# Altium project 28Pins_Project_V1I1.PrjPcb (part 2 of 3)
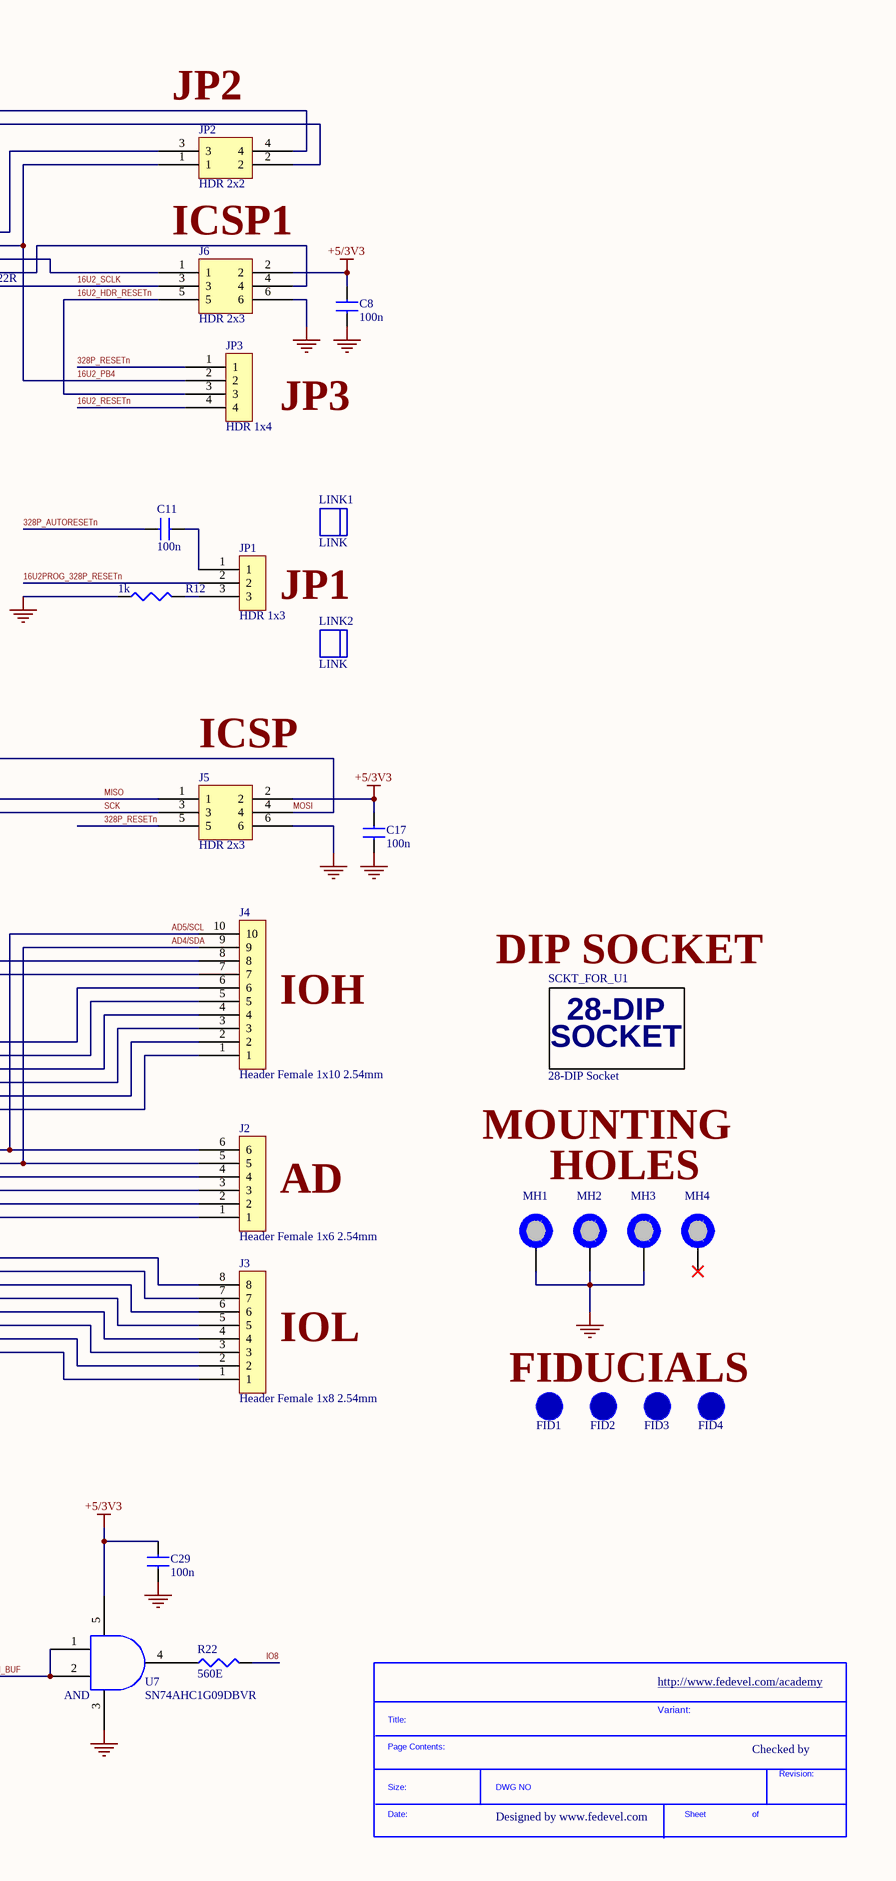
[diagram p3: [03] - 28PINS SCHEMATIC.SchDoc, right]

## Sheet [03] - 28PINS SCHEMATIC.SchDoc: 28Pins (continued)
### Library data of the parts
C1 C2 = EEE-1AA101WR: Cap Aluminum 100uF 10V 20% (5 X 5.4mm) SMD 50mA 1000 hr 85°C T/R; Manufacturer: Panasonic; Life (Hours): 1000Hour; Supplier 1: Digi-Key; Manufacturer Part Number: EEE-1AA101WR; Stock 1: 0; Pricing 1: 1=0.39, 10=0.266, 50=0.1772, 100=0.1505, 500=0.1063 (USD); Mount: Surface Mount,PCB; Case/Package: Radial; Contact Plating: Tin; Min Operating Temperature: -40°C; Max Operating Temperature: 85°C; Capacitance: 100uF; Tolerance: 20%; Ripple Current: 50mA; Voltage Rating: 10V; Packaging: Tape and Reel; Package Quantity: 1; Voltage Rating (DC): 10V; Termination: SMD/SMT; Ripple Current (AC): 50mA; Series: S; Construction: Cylindrical; Diameter: 5mm; Length: 5.5mm; Height: 5.4mm; Height - Seated (Max): 0.213inch; Radiation Hardening: No; Lead Free: Lead Free; RoHS Compliant: Yes; REACH SVHC: Unknown; ComponentLink1URL: https://industrial.panasonic.com/cdbs/www-data/pdf/RDE0000/DME0000COL90.pdf?src-supplier=Mouser; ComponentLink1Description: https://industrial.panasonic.com/cdbs/www-data/pdf/RDE0000/DME0000COL90.pdf?src-supplier=Mouser; ComponentLink2URL: https://industrial.panasonic.com/cdbs/www-data/pdf/RDE0000/DME0000COL90.pdf?src-supplier=Allied+Electronics; ComponentLink2Description: https://industrial.panasonic.com/cdbs/www-data/pdf/RDE0000/DME0000COL90.pdf?src-supplier=Allied+Electronics; ComponentLink3URL: https://industrial.panasonic.com/cdbs/www-data/pdf/RDE0000/DME0000COL90.pdf?src-supplier=Avnet; ComponentLink3Description: https://industrial.panasonic.com/cdbs/www-data/pdf/RDE0000/DME0000COL90.pdf?src-supplier=Avnet; ComponentLink4URL: http://industrial.panasonic.com/www-data/pdf/ABA0000/ABA0000CE2.pdf?src-supplier=Future+Electronics; ComponentLink4Description: http://industrial.panasonic.com/www-data/pdf/ABA0000/ABA0000CE2.pdf?src-supplier=Future+Electronics; ComponentLink5URL: https://industrial.panasonic.com/cdbs/www-data/pdf/RDE0000/DME0000COL90.pdf?src-supplier=Verical; ComponentLink5Description: https://industrial.panasonic.com/cdbs/www-data/pdf/RDE0000/DME0000COL90.pdf?src-supplier=Verical; Supplier Part Number 1: PCE3867CT-ND
C3 C12 C13 C19 C21 C22 C34 = C2012X5R1C106M125AC: CERAMIC CAPACITOR, 10UF, 16V, X5R, 20%, 0805, FULL REEL; Product Range:C Series; Capacitance:10 F; Capacitance Tolerance: 20%; Dielectric Characteristic:X5R; Voltage Rating:16V; Ceramic Capacitor Case:0805 [2012 Metric]; MSL:- ;RoHS Compliant: Yes; Manufacturer: TDK; Supplier 1: Digi-Key; Manufacturer Part Number: C2012X5R1C106M125AC; Stock 1: 0; Mount: Surface Mount; Case/Package: 0805; Number of Pins: 2; Weight: 0.000194oz; Case Code (Metric): 2012; Case Code (Imperial): 0805; Dielectric Material: Ceramic; Min Operating Temperature: -55°C; Max Operating Temperature: 85°C; Capacitance: 10uF; Tolerance: 20%; Voltage Rating: 16V; Packaging: Tape and Reel; Voltage Rating (DC): 16V; Dielectric: X5R; Termination: SMD/SMT; Package Quantity: 1; Composition: Ceramic; Length: 2mm; Height: 1.25mm; Width: 0.049inch; Depth: 1.25mm; Thickness: 0.057inch; REACH SVHC: No SVHC; Lead Free: Lead Free; ComponentLink1URL: https://media.digikey.com/pdf/Data%20Sheets/TDK%20PDFs/Multilayer%20Ceramic%20Chip%20Cap(up%20to%2050V).pdf?src-supplier=Digi-Key; ComponentLink1Description: https://media.digikey.com/pdf/Data%20Sheets/TDK%20PDFs/Multilayer%20Ceramic%20Chip%20Cap(up%20to%2050V).pdf?src-supplier=Digi-Key; ComponentLink2URL: http://www.farnell.com/datasheets/1913358.pdf?src-supplier=Element14; ComponentLink2Description: http://www.farnell.com/datasheets/1913358.pdf?src-supplier=Element14; ComponentLink3URL: https://product.tdk.com/info/en/documents/chara_sheet/C2012X5R1C106M125AC.pdf?src-supplier=Newark; ComponentLink3Description: https://product.tdk.com/info/en/documents/chara_sheet/C2012X5R1C106M125AC.pdf?src-supplier=Newark; Supplier Part Number 1: 445-4115-1-ND
C4-C6 C8 C11 C14-C17 C20 C23 C24 C26 C28-C33 = C2012X7R1H104K085AA: TDK - C2012X7R1H104K085AA - SMD Multilayer Ceramic Capacitor, 0.1 µF, 50 V, 0805 [2012 Metric], ± 10%, X7R, C Series; Capacitance: 100nF; Voltage Rating: 50V; Supplier 1: Digi-Key; Manufacturer: TDK; Manufacturer Part Number: C2012X7R1H104K085AA; Stock 1: 241464; Pricing 1: 1=0.17, 10=0.119, 100=0.0561, 500=0.0394, 1000=0.0326 (USD); Mount: Surface Mount; Case/Package: 0805; Number of Pins: 2; Weight: 0.000194oz; Case Code (Metric): 2012; Case Code (Imperial): 0805; Dielectric Material: Ceramic; Min Operating Temperature: -55°C; Max Operating Temperature: 125°C; Tolerance: 10%; Dielectric: X7R; Packaging: Tape and Reel; Voltage Rating (DC): 50V; Termination: SMD/SMT; Package Quantity: 1; Composition: Ceramic; Voltage: 50V; Length: 2mm; Height: 0.85mm; Depth: 1.25mm; Width: 0.049inch; Thickness: 0.037inch; Radiation Hardening: No; REACH SVHC: No SVHC; Lead Free: Lead Free; ComponentLink1URL: http://uk.rs-online.com/webdocs/1532/0900766b81532cd0.pdf?src-supplier=RSComponents; ComponentLink1Description: http://uk.rs-online.com/webdocs/1532/0900766b81532cd0.pdf?src-supplier=RSComponents; ComponentLink2URL: https://product.tdk.com/info/en/catalog/datasheets/mlcc_commercial_general_en.pdf?src-supplier=Digi-Key; ComponentLink2Description: https://product.tdk.com/info/en/catalog/datasheets/mlcc_commercial_general_en.pdf?src-supplier=Digi-Key; ComponentLink3URL: http://www.tdk.co.jp/tefe02/e412_c.pdf?src-supplier=Future+Electronics; ComponentLink3Description: http://www.tdk.co.jp/tefe02/e412_c.pdf?src-supplier=Future+Electronics; ComponentLink4URL: http://www.farnell.com/datasheets/1796654.pdf?src-supplier=Newark; ComponentLink4Description: http://www.farnell.com/datasheets/1796654.pdf?src-supplier=Newark; ComponentLink5URL: http://www.farnell.com/datasheets/1571323.pdf?src-supplier=Element14; ComponentLink5Description: http://www.farnell.com/datasheets/1571323.pdf?src-supplier=Element14; Supplier Part Number 1: 445-7534-1-ND
C7 = C2012X5R1E105K125AA: TDK - C2012X5R1E105K125AA - SMD Multilayer Ceramic Capacitor, 1 µF, 25 V, 0805 [2012 Metric], ± 10%, X5R, C Series; Capacitance: 1uF; Voltage Rating: 25V; Supplier 1: Digi-Key; Manufacturer: TDK; Manufacturer Part Number: C2012X5R1E105K125AA; Stock 1: 11809; Pricing 1: 1=0.26, 10=0.174, 50=0.1046, 100=0.0883, 500=0.0604, 1000=0.0534 (USD); Mount: Surface Mount; Case/Package: 0805; Number of Pins: 2; Weight: 0.000194oz; Case Code (Metric): 2012; Case Code (Imperial): 0805; Dielectric Material: Ceramic; Min Operating Temperature: -55°C; Max Operating Temperature: 85°C; Tolerance: 10%; Package Quantity: 2000; Packaging: Tape and Reel; Voltage Rating (DC): 25V; Dielectric: X5R; Termination: SMD/SMT; Composition: Ceramic; Voltage: 25V; Length: 2mm; Height: 1.25mm; Width: 0.049inch; Thickness: 0.057inch; Depth: 1.25mm; Radiation Hardening: No; REACH SVHC: No SVHC; Lead Free: Lead Free; ComponentLink1URL: http://uk.rs-online.com/webdocs/1532/0900766b81532cd0.pdf?src-supplier=RSComponents; ComponentLink1Description: http://uk.rs-online.com/webdocs/1532/0900766b81532cd0.pdf?src-supplier=RSComponents; ComponentLink2URL: http://www.tdk.co.jp/tefe02/e412_c.pdf?src-supplier=Future+Electronics; ComponentLink2Description: http://www.tdk.co.jp/tefe02/e412_c.pdf?src-supplier=Future+Electronics; ComponentLink3URL: http://www.farnell.com/datasheets/1744655.pdf?src-supplier=Element14; ComponentLink3Description: http://www.farnell.com/datasheets/1744655.pdf?src-supplier=Element14; ComponentLink4URL: https://product.tdk.com/info/en/catalog/spec/mlccspec_commercial_general_midvoltage_en.pdf?src-supplier=Verical; ComponentLink4Description: https://product.tdk.com/info/en/catalog/spec/mlccspec_commercial_general_midvoltage_en.pdf?src-supplier=Verical; Supplier Part Number 1: 445-1419-1-ND
C9 C10 C25 C27 = C0805C180J5GACTU: CAP CER 18PF 50V C0G/NP0 0805; Manufacturer: KEMET; Dielectric Material: Ceramic; Tolerance: 5%; Dielectric: C0G; Temperature Coefficient: 30ppm/°C; Supplier 1: Digi-Key; Manufacturer Part Number: C0805C180J5GACTU; Stock 1: 173219; Pricing 1: 1=0.14, 10=0.1, 100=0.0468, 500=0.0328, 1000=0.0272 (USD); Mount: Surface Mount; Case/Package: 0805; Contact Plating: Tin,Matte; Min Operating Temperature: -55°C; Max Operating Temperature: 125°C; Capacitance: 18pF; Packaging: Tape and Reel; Voltage: 50V; Termination: SMD/SMT; Voltage Rating (DC): 50V; Length: 2mm; Height: 0.78mm; Depth: 1.25mm; Radiation Hardening: No; Lead Free: Lead Free; ComponentLink1URL: http://www.farnell.com/datasheets/1769375.pdf?src-supplier=Element14; ComponentLink1Description: http://www.farnell.com/datasheets/1769375.pdf?src-supplier=Element14; ComponentLink2URL: https://www.verical.com/server-webapp/html/getDatasheet?partID=385668&src-supplier=Verical; ComponentLink2Description: https://www.verical.com/server-webapp/html/getDatasheet?partID=385668&src-supplier=Verical; ComponentLink3URL: https://www.verical.com/server-webapp/html/getDatasheet?partID=759702&src-supplier=Verical; ComponentLink3Description: https://www.verical.com/server-webapp/html/getDatasheet?partID=759702&src-supplier=Verical; Supplier Part Number 1: 399-1112-1-ND
D1 = LGL29K-G2J1-24-Z: LED Uni-Color Green 572nm 2-Pin Chip 0603(1608Metric) T/R; Manufacturer: Osram Opto; Lens Color: White; Forward Current: 20mA; Forward Voltage: 2.2V; Luminous Intensity: 5.6mcd; Viewing Angle: 160°; Lens Style: Flat,Diffused,Colorless,Rectangular; Test Current: 2mA; Dominant Wavelength: 570nm; Luminous Flux: 0.012lm; Number of LEDs: 1; Lens Transparency: Diffused; Reverse Voltage: 12V; Lens Size: 0.8mm; Supplier 1: Digi-Key; Manufacturer Part Number: LGL29K-G2J1-24-Z; Stock 1: 10849; Pricing 1: 1=0.42, 10=0.304, 100=0.1983, 500=0.1425, 1000=0.1115, 2500=0.1022 (USD); Mount: Surface Mount; Case/Package: 0603; Number of Pins: 2; Color: Green; Case Code (Metric): 1608; Case Code (Imperial): 0603; Min Operating Temperature: -40°C; Max Operating Temperature: 100°C; Illumination Color: Green; Packaging: Tape and Reel; Package Quantity: 5000; Number of Elements: 1; Length: 1.3mm; Height: 0.65mm; Width: 0.8mm; Depth: 0.8mm; Radiation Hardening: No; ComponentLink1URL: http://www.mouser.com/ds/2/311/LG%20L29K%20-%20SMARTLED%200603-335234.pdf?src-supplier=Mouser; ComponentLink1Description: http://www.mouser.com/ds/2/311/LG%20L29K%20-%20SMARTLED%200603-335234.pdf?src-supplier=Mouser; ComponentLink2URL: https://dammedia.osram.info/media/resource/hires/osram-dam-2493945/LG%20L29K.pdf?src-supplier=Digi-Key; ComponentLink2Description: https://dammedia.osram.info/media/resource/hires/osram-dam-2493945/LG%20L29K.pdf?src-supplier=Digi-Key; ComponentLink3URL: https://www.verical.com/server-webapp/html/getDatasheet?partID=571127&src-supplier=Verical; ComponentLink3Description: https://www.verical.com/server-webapp/html/getDatasheet?partID=571127&src-supplier=Verical; Supplier Part Number 1: 475-2709-1-ND
D2-D4 = LOL29K-H2K1-24-Z: OSRAM - LO L29K-H2K1-24-Z - SMARTLED 0603 ORANGE; Manufacturer: Osram Opto; Lens Color: White; Forward Current: 20mA; Forward Voltage: 2.2V; Luminous Intensity: 9mcd; Viewing Angle: 160°; Lens Style: Flat,Diffused,Colorless,Rectangular; Test Current: 2mA; Dominant Wavelength: 606nm; Luminous Flux: 0.025lm; Number of LEDs: 1; Lens Transparency: Diffused; Reverse Voltage: 12V; Lens Size: 0.8mm; Supplier 1: Digi-Key; Manufacturer Part Number: LOL29K-H2K1-24-Z; Stock 1: 17027; Pricing 1: 1=0.51, 10=0.359, 100=0.2092, 500=0.1435, 1000=0.1196, 2500=0.1076 (USD); Mount: Surface Mount; Case/Package: 0603; Number of Pins: 2; Color: Orange; Case Code (Metric): 1608; Case Code (Imperial): 0603; Min Operating Temperature: -40°C; Max Operating Temperature: 100°C; Illumination Color: Orange; Packaging: Tape and Reel; Package Quantity: 5000; Number of Elements: 1; Length: 1.3mm; Height: 0.65mm; Width: 0.8mm; Depth: 0.8mm; Radiation Hardening: No; ComponentLink1URL: https://dammedia.osram.info/media/resource/hires/osram-dam-2493882/LO%20L29K.pdf?src-supplier=Digi-Key; ComponentLink1Description: https://dammedia.osram.info/media/resource/hires/osram-dam-2493882/LO%20L29K.pdf?src-supplier=Digi-Key; ComponentLink2URL: https://www.verical.com/server-webapp/html/getDatasheet?partID=693885&src-supplier=Verical; ComponentLink2Description: https://www.verical.com/server-webapp/html/getDatasheet?partID=693885&src-supplier=Verical; Supplier Part Number 1: 475-2740-1-ND
D5 D6 = BAT54HT1G: Small Signal Schottky Diode, Single, 30 V, 200 mA, 800 mV, 600 mA, 150 C ;RoHS Compliant: Yes; Manufacturer: ON Semiconductor / Fairchild; Forward Voltage: 800mV; Forward Current: 200mA; Recovery Time: 5ns; Max Repetitive Reverse Voltage (Vrrm): 30V; Peak Non-Repetitive Surge Current: 600mA; Peak Reverse Current: 2uA; Power Dissipation: 200mW; Polarity: Standard; Capacitance: 10pF; Supplier 1: Digi-Key; Manufacturer Part Number: BAT54HT1G; Stock 1: 230613; Pricing 1: 1=0.2, 10=0.181, 25=0.1724, 100=0.0759, 500=0.0596, 1000=0.0414 (USD); Mount: Surface Mount; Number of Pins: 2; Contact Plating: Tin,Matte; Min Operating Temperature: -55°C; Max Operating Temperature: 150°C; Packaging: Tape and Reel; Package Quantity: 3000; Average Rectified Current: 200mA; Reverse Recovery Time: 5ns; Max Forward Surge Current (Ifsm): 600mA; Element Configuration: Single; Max Reverse Voltage (DC): 30V; Max Surge Current: 600mA; Voltage Rating (DC): 30V; Current Rating: 200mA; Output Current: 200mA; Reverse Voltage: 30V; Max Reverse Leakage Current: 2uA; Length: 1.8mm; Height: 1mm; Width: 1.35mm; Radiation Hardening: No; Lead Free: Lead Free; REACH SVHC: No SVHC; ComponentLink1URL: http://www.fairchildsemi.com/datasheets/BA/BAT54HT1G.pdf?src-supplier=Digi-Key; ComponentLink1Description: http://www.fairchildsemi.com/datasheets/BA/BAT54HT1G.pdf?src-supplier=Digi-Key; ComponentLink2URL: http://www.farnell.com/datasheets/2251626.pdf?src-supplier=Element14; ComponentLink2Description: http://www.farnell.com/datasheets/2251626.pdf?src-supplier=Element14; ComponentLink3URL: http://www.jameco.com/Jameco/Products/ProdDS/806549.pdf?src-supplier=Jameco; ComponentLink3Description: http://www.jameco.com/Jameco/Products/ProdDS/806549.pdf?src-supplier=Jameco; ComponentLink4URL: http://www.farnell.com/datasheets/2251626.pdf?src-supplier=Newark; ComponentLink4Description: http://www.farnell.com/datasheets/2251626.pdf?src-supplier=Newark; ComponentLink5URL: http://www.mouser.com/ds/2/149/BAT54HT1G-104602.pdf?src-supplier=Mouser; ComponentLink5Description: http://www.mouser.com/ds/2/149/BAT54HT1G-104602.pdf?src-supplier=Mouser; ComponentLink6URL: http://www.farnell.com/datasheets/1727620.pdf?src-supplier=Element14; ComponentLink6Description: http://www.farnell.com/datasheets/1727620.pdf?src-supplier=Element14; ComponentLink7URL: https://media.digikey.com/pdf/Data%20Sheets/Fairchild%20PDFs/BAT54HT1G_Rev_1.2.pdf?src-supplier=Avnet; ComponentLink7Description: https://media.digikey.com/pdf/Data%20Sheets/Fairchild%20PDFs/BAT54HT1G_Rev_1.2.pdf?src-supplier=Avnet; ComponentLink8URL: http://www.onsemi.com/pub/Collateral/BAT54HT1-D.PDF?src-supplier=Avnet; ComponentLink8Description: http://www.onsemi.com/pub/Collateral/BAT54HT1-D.PDF?src-supplier=Avnet; ComponentLink9URL: http://www.onsemi.com/pub/Collateral/BAT54HT1-D.PDF?src-supplier=Digi-Key; ComponentLink9Description: http://www.onsemi.com/pub/Collateral/BAT54HT1-D.PDF?src-supplier=Digi-Key; ComponentLink10URL: http://uk.rs-online.com/webdocs/11a6/0900766b811a63a9.pdf?src-supplier=RSComponents; ComponentLink10Description: http://uk.rs-online.com/webdocs/11a6/0900766b811a63a9.pdf?src-supplier=RSComponents; ComponentLink11URL: https://media.digikey.com/pdf/Data%20Sheets/Fairchild%20PDFs/BAT54HT1G_Rev_1.2.pdf?src-supplier=Mouser; ComponentLink11Description: https://media.digikey.com/pdf/Data%20Sheets/Fairchild%20PDFs/BAT54HT1G_Rev_1.2.pdf?src-supplier=Mouser; ComponentLink12URL: http://www.fairchildsemi.com/ds/BA/BAT54HT1G.pdf?src-supplier=Future+Electronics; ComponentLink12Description: http://www.fairchildsemi.com/ds/BA/BAT54HT1G.pdf?src-supplier=Future+Electronics; ComponentLink13URL: http://www.produktinfo.conrad.com/datenblaetter/1200000-1299999/001262925-da-01-en-DIODE_SCHOTTKY_30V_BAT54HT1G_SOD_323_FSC.pdf?src-supplier=Conrad; ComponentLink13Description: http://www.produktinfo.conrad.com/datenblaetter/1200000-1299999/001262925-da-01-en-DIODE_SCHOTTKY_30V_BAT54HT1G_SOD_323_FSC.pdf?src-supplier=Conrad; Supplier Part Number 1: BAT54HT1GOSCT-ND
FB1-FB3 = MPZ2012S601AT000: FERRITE BEAD 600 OHM 0805 1LN; Manufacturer: TDK; Impedance: 600R; Current Rating: 2A; DC Resistance (DCR): 100mR; Supplier 1: Digi-Key; Manufacturer Part Number: MPZ2012S601AT000; Stock 1: 224324; Pricing 1: 1=0.11, 10=0.091, 25=0.0704, 50=0.0584, 100=0.0503, 250=0.0403, 500=0.0362, 1000=0.0302 (USD); Mount: Surface Mount; Case/Package: 0805; Case Code (Metric): 2012; Case Code (Imperial): 0805; Packaging: Tape and Reel; Package Quantity: 1; Max DC Current: 2A; Length: 0.079inch; Height: 0.041inch; Width: 0.049inch; REACH SVHC: No SVHC; Lead Free: Lead Free; ComponentLink1URL: https://media.digikey.com/pdf/Data%20Sheets/TDK%20PDFs/MPZ_Series_Br.pdf?src-supplier=Digi-Key; ComponentLink1Description: https://media.digikey.com/pdf/Data%20Sheets/TDK%20PDFs/MPZ_Series_Br.pdf?src-supplier=Digi-Key; ComponentLink2URL: https://product.tdk.com/info/en/catalog/datasheets/beads_commercial_power_mpz2012_en.pdf?src-supplier=Digi-Key; ComponentLink2Description: https://product.tdk.com/info/en/catalog/datasheets/beads_commercial_power_mpz2012_en.pdf?src-supplier=Digi-Key; Supplier Part Number 1: 445-2206-1-ND
FID1-FID4 = FID_1MMC: Fiducial 40mil Diameter, 120mil Mask
J1 J3 = M20-7820842: 2.54mm (0.1") Pitch SIL Vertical PC Tail Socket Assembly, selective gold + tin, 8 contacts; Manufacturer: Harwin; Number of Contacts: 8; Max Current Rating: 3A; Contact Resistance: 20mR; Connector Type: Receptacle,Socket; Supplier 1: Digi-Key; Manufacturer Part Number: M20-7820842; Stock 1: 0; Pricing 1: 1=1.1, 10=0.972, 100=0.8382, 500=0.6858, 1000=0.6096, 5000=0.5334, 10000=0.5067 (USD); Mount: Through Hole; Case/Package: SIL; Weight: 0.025397oz; Contact Plating: Tin,Gold; Color: Black; Contact Material: Bronze; Housing Color: Black; Housing Material: Polyamide; Min Operating Temperature: -40°C; Max Operating Temperature: 105°C; Number of Rows: 1; Termination: Solder; Contact Gender: Female; Package Quantity: 29; Packaging: Rail/Tube; Number of Positions: 8; Orientation: Straight; Gender: Female; Length: 20.72mm; Pitch: 2.54mm; Depth: 2.5mm; Radiation Hardening: No; ComponentLink1URL: https://cdn.harwin.com/pdfs/Harwin_PC_Connectors_M20.pdf?src-supplier=Avnet+Europe; ComponentLink1Description: https://cdn.harwin.com/pdfs/Harwin_PC_Connectors_M20.pdf?src-supplier=Avnet+Europe; ComponentLink2URL: http://www.harwin.com/include/downloads/drawings/M20-782.PDF?src-supplier=Avnet; ComponentLink2Description: http://www.harwin.com/include/downloads/drawings/M20-782.PDF?src-supplier=Avnet; Supplier Part Number 1: 952-1823-ND
J2 = M20-7820646: 06-WAY SIL VERT SOCKET L/FREE; Manufacturer: Harwin; Number of Contacts: 6; Max Current Rating: 3A; Contact Resistance: 20mR; Connector Type: Receptacle,Socket; Supplier 1: Digi-Key; Manufacturer Part Number: M20-7820646; Stock 1: 1249; Pricing 1: 1=0.96, 10=0.842, 100=0.726, 500=0.594, 1000=0.528, 5000=0.462, 10000=0.4389 (USD); Mount: Through Hole; Case/Package: SIL; Color: Black; Contact Plating: Tin; Contact Material: Bronze; Housing Color: Black; Housing Material: Nylon; Min Operating Temperature: -40°C; Max Operating Temperature: 105°C; Number of Rows: 1; Termination: Solder; Packaging: Rail/Tube; Contact Gender: Female; Package Quantity: 38; Number of Positions: 6; Orientation: Straight; Gender: Female; Length: 15.64mm; Pitch: 2.54mm; Depth: 2.5mm; Radiation Hardening: No; ComponentLink1URL: http://www.harwin.com/include/downloads/pdfs/2010PAGE120.PDF?src-supplier=Avnet; ComponentLink1Description: http://www.harwin.com/include/downloads/pdfs/2010PAGE120.PDF?src-supplier=Avnet; ComponentLink2URL: https://cdn.harwin.com/pdfs/M20-782.pdf?src-supplier=Newark; ComponentLink2Description: https://cdn.harwin.com/pdfs/M20-782.pdf?src-supplier=Newark; ComponentLink3URL: https://cdn.harwin.com/pdfs/M20-782.pdf?src-supplier=Digi-Key; ComponentLink3Description: https://cdn.harwin.com/pdfs/M20-782.pdf?src-supplier=Digi-Key; ComponentLink4URL: http://components.arrow.com/part/dataview/0323_00725884?src-supplier=Arrow+Europe; ComponentLink4Description: http://components.arrow.com/part/dataview/0323_00725884?src-supplier=Arrow+Europe; ComponentLink5URL: https://cdn.harwin.com/pdfs/Harwin_PC_Connectors_M20.pdf?src-supplier=Avnet+Europe; ComponentLink5Description: https://cdn.harwin.com/pdfs/Harwin_PC_Connectors_M20.pdf?src-supplier=Avnet+Europe; ComponentLink6URL: https://cdn.harwin.com/pdfs/Harwin_PC_Connectors_M20.pdf?src-supplier=Mouser; ComponentLink6Description: https://cdn.harwin.com/pdfs/Harwin_PC_Connectors_M20.pdf?src-supplier=Mouser; ComponentLink7URL: https://cdn.harwin.com/pdfs/Harwin_PC_Connectors_M20.pdf?src-supplier=RSComponents; ComponentLink7Description: https://cdn.harwin.com/pdfs/Harwin_PC_Connectors_M20.pdf?src-supplier=RSComponents; ComponentLink8URL: https://cdn.harwin.com/pdfs/M20-782.pdf?src-supplier=Farnell; ComponentLink8Description: https://cdn.harwin.com/pdfs/M20-782.pdf?src-supplier=Farnell; ComponentLink9URL: https://cdn.harwin.com/pdfs/Harwin_PC_Connectors_M20.pdf?src-supplier=TTI; ComponentLink9Description: https://cdn.harwin.com/pdfs/Harwin_PC_Connectors_M20.pdf?src-supplier=TTI; Supplier Part Number 1: 952-1809-ND
J4 = M20-7821046: HARWIN - M20-7821046 - Board-To-Board Connector, M20 Series, Through Hole, Receptacle, 10, 2.54 mm, Tin Plated Contacts; Number of Contacts: 10; Max Current Rating: 3A; Contact Resistance: 20mR; Mating Cycles: 50; Connector Type: Receptacle,Socket; Insulation Resistance: 1MR; Hole Diameter: 0.8mm; Supplier 1: Digi-Key; Manufacturer: Harwin; Manufacturer Part Number: M20-7821046; Stock 1: 431; Pricing 1: 1=1.28, 10=1.122, 100=0.968, 500=0.792, 1000=0.704, 5000=0.616, 10000=0.5852 (USD); Mount: Through Hole; Case/Package: SIL; Color: Black; Contact Plating: Tin; Contact Material: Bronze; Housing Color: Black; Housing Material: Polyamide; Min Operating Temperature: -40°C; Max Operating Temperature: 105°C; Number of Rows: 1; Termination: Solder; Packaging: Rail/Tube; Contact Gender: Female; Package Quantity: 23; Current Rating: 3A; Number of Positions: 10; Gender: Receptacle; Orientation: Straight; Length: 25.8mm; Pitch: 2.54mm; Lead Pitch: 2.54mm; Depth: 2.5mm; Radiation Hardening: No; REACH SVHC: No SVHC; ComponentLink1URL: https://www.verical.com/server-webapp/html/getDatasheet?partID=559226&src-supplier=Verical; ComponentLink1Description: https://www.verical.com/server-webapp/html/getDatasheet?partID=559226&src-supplier=Verical; ComponentLink2URL: https://cdn.harwin.com/pdfs/M20-782.pdf?src-supplier=Digi-Key; ComponentLink2Description: https://cdn.harwin.com/pdfs/M20-782.pdf?src-supplier=Digi-Key; ComponentLink3URL: http://www.harwin.com/include/downloads/drawings/M20-782.PDF?src-supplier=Avnet; ComponentLink3Description: http://www.harwin.com/include/downloads/drawings/M20-782.PDF?src-supplier=Avnet; ComponentLink4URL: https://cdn.harwin.com/pdfs/Harwin_PC_Connectors_M20.pdf?src-supplier=Avnet+Europe; ComponentLink4Description: https://cdn.harwin.com/pdfs/Harwin_PC_Connectors_M20.pdf?src-supplier=Avnet+Europe; ComponentLink5URL: http://uk.rs-online.com/webdocs/1422/0900766b81422659.pdf?src-supplier=RSComponents; ComponentLink5Description: http://uk.rs-online.com/webdocs/1422/0900766b81422659.pdf?src-supplier=RSComponents; Supplier Part Number 1: 952-1847-ND
J5 J6 = 67997-106HLF: CONN HEADER 6POS .100 STR 30AU; Manufacturer: Amphenol FCI; Number of Contacts: 6; Current Rating: 3A; Voltage Rating: 1.5kV; Insulation Resistance: 5GR; Gender: Male; Connector Type: Male Pin; Pitch: 2.54mm; Row Spacing: 0.1inch; Contact Post Length: 3.05mm; Supplier 1: Digi-Key; Manufacturer Part Number: 67997-106HLF; Stock 1: 1596; Pricing 1: 1=1.78, 10=1.614, 100=1.3837, 500=1.1531, 1000=0.9884, 5000=0.8763, 10000=0.8566 (USD); Mount: Through Hole; Contact Plating: Gold,GXT; Contact Material: Bronze; Color: Black; Housing Color: Black; Housing Material: Thermoplastic; Min Operating Temperature: -65°C; Max Operating Temperature: 125°C; Number of Rows: 2; Termination: Through Hole; Packaging: Bulk; Package Quantity: 100; Contact Gender: Male; Number of Positions: 6; Max Voltage Rating (AC): 1.5kV; Orientation: Straight; Length: 7.62mm; Contact Mating Length: 0.23inch; Depth: 4.83mm; Radiation Hardening: No; REACH SVHC: No SVHC; Lead Free: Lead Free; Flammability Rating: UL94 V-0; ComponentLink1URL: https://cdn.amphenol-icc.com/media/wysiwyg/files/drawing/67996.pdf?src-supplier=Avnet; ComponentLink1Description: https://cdn.amphenol-icc.com/media/wysiwyg/files/drawing/67996.pdf?src-supplier=Avnet; ComponentLink2URL: https://cdn.amphenol-icc.com/media/wysiwyg/files/drawing/67996.pdf?src-supplier=Digi-Key; ComponentLink2Description: https://cdn.amphenol-icc.com/media/wysiwyg/files/drawing/67996.pdf?src-supplier=Digi-Key; ComponentLink3URL: https://cdn.amphenol-icc.com/media/wysiwyg/files/drawing/67996.pdf?src-supplier=Mouser; ComponentLink3Description: https://cdn.amphenol-icc.com/media/wysiwyg/files/drawing/67996.pdf?src-supplier=Mouser; ComponentLink4URL: https://cdn.amphenol-icc.com/media/wysiwyg/files/drawing/67996.pdf?src-supplier=Avnet+Europe; ComponentLink4Description: https://cdn.amphenol-icc.com/media/wysiwyg/files/drawing/67996.pdf?src-supplier=Avnet+Europe; Supplier Part Number 1: 609-3393-ND
J7 = 10118193-0001LF: CONN USB MICRO B RECPT SMT R/A; Manufacturer: Amphenol FCI; Gender: Female; Current Rating: 1.8A; Connector Type: USB,Receptacle; Number of Contacts: 5; Number of Ports: 1; Insulation Resistance: 1GR; Max Voltage Rating (AC): 100V; Pitch: 0.65mm; Supplier 1: Digi-Key; Manufacturer Part Number: 10118193-0001LF; Stock 1: 167375; Pricing 1: 1=0.43, 10=0.405, 25=0.3648, 50=0.3242, 100=0.3107, 250=0.2837, 500=0.2702 (USD); Mount: Surface Mount,Horizontal; Contact Plating: Gold; Contact Material: Copper Alloy; Number of Terminals: 5; Housing Material: Polymer; Color: Black; Min Operating Temperature: -55°C; Max Operating Temperature: 85°C; Packaging: Tape and Reel; Termination: Solder; Package Quantity: 1200; Voltage Rating: 100V; Orientation: Right Angle; Features: Shielded; Length: 7.86mm; Depth: 5.67mm; Radiation Hardening: No; Flammability Rating: UL94 V-0; ComponentLink1URL: https://cdn.amphenol-icc.com/media/wysiwyg/files/documentation/datasheet/inputoutput/io_usb_micro.pdf?src-supplier=Digi-Key; ComponentLink1Description: https://cdn.amphenol-icc.com/media/wysiwyg/files/documentation/datasheet/inputoutput/io_usb_micro.pdf?src-supplier=Digi-Key; ComponentLink2URL: https://cdn.amphenol-icc.com/media/wysiwyg/files/documentation/datasheet/inputoutput/io_usb_micro.pdf?src-supplier=Arrow+Electronics; ComponentLink2Description: https://cdn.amphenol-icc.com/media/wysiwyg/files/documentation/datasheet/inputoutput/io_usb_micro.pdf?src-supplier=Arrow+Electronics; ComponentLink3URL: http://www.amphenol-icc.com/media/wysiwyg/files/drawing/10118193.pdf?src-supplier=Digi-Key; ComponentLink3Description: http://www.amphenol-icc.com/media/wysiwyg/files/drawing/10118193.pdf?src-supplier=Digi-Key; ComponentLink4URL: https://cdn.amphenol-icc.com/media/wysiwyg/files/documentation/datasheet/inputoutput/io_usb_micro.pdf?src-supplier=Verical; ComponentLink4Description: https://cdn.amphenol-icc.com/media/wysiwyg/files/documentation/datasheet/inputoutput/io_usb_micro.pdf?src-supplier=Verical; ComponentLink5URL: https://cdn.amphenol-icc.com/media/wysiwyg/files/documentation/datasheet/inputoutput/io_usb_micro.pdf?src-supplier=Allied+Electronics; ComponentLink5Description: https://cdn.amphenol-icc.com/media/wysiwyg/files/documentation/datasheet/inputoutput/io_usb_micro.pdf?src-supplier=Allied+Electronics; ComponentLink6URL: https://cdn.amphenol-icc.com/media/wysiwyg/files/documentation/datasheet/inputoutput/io_usb_micro.pdf?src-supplier=Mouser; ComponentLink6Description: https://cdn.amphenol-icc.com/media/wysiwyg/files/documentation/datasheet/inputoutput/io_usb_micro.pdf?src-supplier=Mouser; Supplier Part Number 1: 609-4616-1-ND
J8 J9 = PAD_WITH_HOLE_4MMx1.5MM: Pad With Hole 4mm x 1.5mm
JP1 JP4 = 68000-103HLF: AMPHENOL ICC - 68000-103HLF - Board-To-Board Connector, 2.54 mm, 3 Contacts, Header, FCI BergStik II 68000 Series, Through Hole; Supplier 1: Digi-Key; Manufacturer: Amphenol ICC; Manufacturer Part Number: 68000-103HLF; Stock 1: 24213; Pricing 1: 1=0.29, 10=0.279, 100=0.195, 500=0.1672, 1000=0.1393, 5000=0.1194, 10000=0.1114 (USD); Supplier Part Number 1: 609-3461-ND
JP2 = 68602-204HLF: CONN HEADER VERT 4POS 2.54MM; Manufacturer: Amphenol FCI; Current Rating: 3A; Voltage Rating: 1.5kV; Number of Positions: 4; Insulation Resistance: 5GR; Gender: Male; Connector Type: Male Pin; Row Spacing: 0.1inch; Contact Post Length: 3.81mm; Supplier 1: Digi-Key; Manufacturer Part Number: 68602-204HLF; Stock 1: 1706; Pricing 1: 1=0.34, 10=0.319, 100=0.2232, 500=0.1913, 1000=0.1594, 5000=0.1367, 10000=0.1275 (USD); Mount: Through Hole; Contact Plating: Gold,GXT; Color: Black; Contact Material: Bronze; Housing Material: Thermoplastic; Min Operating Temperature: -65°C; Max Operating Temperature: 125°C; Packaging: Bulk; Number of Rows: 2; Package Quantity: 100; Contact Gender: Male; Termination: Solder; Number of Contacts: 4; Pitch: 2.54mm; Contact Mating Length: 0.23inch; Radiation Hardening: No; Flammability Rating: UL94 V-0; ComponentLink1URL: https://cdn.amphenol-icc.com/media/wysiwyg/files/drawing/67996.pdf?src-supplier=Digi-Key; ComponentLink1Description: https://cdn.amphenol-icc.com/media/wysiwyg/files/drawing/67996.pdf?src-supplier=Digi-Key; Supplier Part Number 1: 609-3369-ND
JP3 = 68001-204HLF: CONN HEADER VERT 4POS 2.54MM; Manufacturer: Amphenol FCI; Current Rating: 3A; Voltage Rating: 1.5kV; Number of Positions: 4; Insulation Resistance: 5GR; Gender: Male; Connector Type: Male Pin; Contact Post Length: 3.05mm; Supplier 1: Digi-Key; Manufacturer Part Number: 68001-204HLF; Stock 1: 2865; Pricing 1: 1=0.38, 10=0.357, 100=0.2501, 500=0.2144, 1000=0.1787, 5000=0.1532, 10000=0.1429 (USD); Mount: Through Hole; Color: Black; Contact Plating: Gold,GXT; Contact Material: Bronze; Housing Material: Thermoplastic; Min Operating Temperature: -65°C; Max Operating Temperature: 125°C; Package Quantity: 100; Number of Rows: 1; Packaging: Bulk; Contact Gender: Male; Termination: Solder; Number of Contacts: 4; Orientation: Straight; Pitch: 2.54mm; Contact Mating Length: 0.23inch; Radiation Hardening: No; Flammability Rating: UL94 V-0; ComponentLink1URL: https://cdn.amphenol-icc.com/media/wysiwyg/files/drawing/68000.pdf?src-supplier=Digi-Key; ComponentLink1Description: https://cdn.amphenol-icc.com/media/wysiwyg/files/drawing/68000.pdf?src-supplier=Digi-Key; ComponentLink2URL: https://cdn.amphenol-icc.com/media/wysiwyg/files/drawing/68000.pdf?src-supplier=Mouser; ComponentLink2Description: https://cdn.amphenol-icc.com/media/wysiwyg/files/drawing/68000.pdf?src-supplier=Mouser; Supplier Part Number 1: 609-3402-ND
L1 = L1210R2R2MDWIT: FIXED IND 2.2UH 2A 80 MOHM SMD; Manufacturer: KEMET; Core Material: Ferrite; Tolerance: 20%; Shielding: Unshielded; Self Resonant Frequency: 190MHz; DC Resistance (DCR): 80mR; Test Frequency: 100kHz; DC Current: 1.13A; Supplier 1: Digi-Key; Manufacturer Part Number: L1210R2R2MDWIT; Stock 1: 13849; Pricing 1: 1=0.5, 10=0.437, 25=0.406, 50=0.3436, 100=0.3124, 250=0.2936, 500=0.2624 (USD); Mount: Surface Mount; Case/Package: 1210; Case Code (Metric): 3225; Case Code (Imperial): 1210; Min Operating Temperature: -40°C; Max Operating Temperature: 105°C; Inductance: 2.2uH; Max DC Current: 2A; Package Quantity: 1000; Current Rating: 2A; Packaging: Tape and Reel; Inductance Tolerance: 20%; Resistor Type: Wirewound,Ceramic; Termination: SMD/SMT; Series: L-DWI; Length: 0.126inch; Width: 0.098inch; Height: 2.5mm; Height - Seated (Max): 0.106inch; Depth: 2.7mm; Radiation Hardening: No; REACH SVHC: No SVHC; Military Standard: Not; RoHS Compliant: Yes; ComponentLink1URL: http://www.farnell.com/datasheets/27262.pdf?src-supplier=Element14; ComponentLink1Description: http://www.farnell.com/datasheets/27262.pdf?src-supplier=Element14; ComponentLink2URL: https://api.kemet.com/component-edge/download/datasheet/L1210R2R2MDWIT.pdf?src-supplier=Digi-Key; ComponentLink2Description: https://api.kemet.com/component-edge/download/datasheet/L1210R2R2MDWIT.pdf?src-supplier=Digi-Key; ComponentLink3URL: https://content.kemet.com/datasheets/F3115.pdf?src-supplier=Mouser; ComponentLink3Description: https://content.kemet.com/datasheets/F3115.pdf?src-supplier=Mouser; ComponentLink4URL: http://www.kemet.com/Lists/ProductCatalog/Attachments/57/F3115.pdf?src-supplier=Avnet; ComponentLink4Description: http://www.kemet.com/Lists/ProductCatalog/Attachments/57/F3115.pdf?src-supplier=Avnet; ComponentLink5URL: https://content.kemet.com/datasheets/F3115.pdf?src-supplier=Avnet+Europe; ComponentLink5Description: https://content.kemet.com/datasheets/F3115.pdf?src-supplier=Avnet+Europe; Supplier Part Number 1: 399-9598-1-ND
LINK1-LINK3 = QPC02SXGN-RC: CONN JUMPER SHORTING .100" GOLD; Manufacturer: Sullins; Number of Positions: 2; Pitch: 0.1inch; Supplier 1: Digi-Key; Manufacturer Part Number: QPC02SXGN-RC; Stock 1: 647683; Pricing 1: 1=0.1, 25=0.044, 50=0.0378, 250=0.0315, 750=0.0284, 1000=0.0265, 12000=0.0202, 24000=0.0183, 48000=0.0182 (USD); Case/Package: 100; Contact Plating: Gold; Package Quantity: 2000; Packaging: Bulk; Height: 0.235inch; Lead Free: Lead Free; ComponentLink1URL: https://s3.amazonaws.com/catalogspreads-pdf/PAGE128-129%20.100%20JUMPER.pdf?src-supplier=Digi-Key; ComponentLink1Description: https://s3.amazonaws.com/catalogspreads-pdf/PAGE128-129%20.100%20JUMPER.pdf?src-supplier=Digi-Key; Supplier Part Number 1: S9337-ND
MH1-MH3 = MH_7.4MMC_3.2MMD: Mounting Hole 74mm dia, 3.2mm drill
MH4 = MH_7.4MMNC_3.2MMD: Mounting Hole 7.4mm dia (Non Copper), 3.2mm drill (NPTH)
R1 = RC0805FR-07100KL: YAGEO         RC0805FR-07100KL            RES, THICK FILM, 100K, 1%, 0.125W, 0805, REEL; Resistance: 100kR; Temperature Coefficient: 100ppm/°C; Voltage Rating (DC): 150V; Power Rating: 125mW; Supplier 1: Digi-Key; Manufacturer: Yageo; Manufacturer Part Number: RC0805FR-07100KL; Stock 1: 3774868; Pricing 1: 1=0.1, 10=0.039, 100=0.0157, 1000=0.0071, 2500=0.0061 (USD); Case/Package: 0805; Number of Pins: 2; Case Code (Metric): 2012; Case Code (Imperial): 0805; Min Operating Temperature: -55°C; Max Operating Temperature: 155°C; Tolerance: 1%; Packaging: Tape and Reel; Composition: Thick Film; Voltage Rating: 150V; Package Quantity: 1; Number of Terminations: 2; Termination: SMD/SMT; Military Standard: Not; Max Power Dissipation: 125mW; Features: Moisture Resistant; Length: 2mm; Height: 0.024inch; Width: 0.049inch; Depth: 1.25mm; Lead Pitch: 0.4mm; REACH SVHC: Unknown; Lead Free: Lead Free; ComponentLink1URL: http://www.yageo.com/documents/recent/PYu-RC_Group_51_RoHS_L_10.pdf?src-supplier=Digi-Key; ComponentLink1Description: http://www.yageo.com/documents/recent/PYu-RC_Group_51_RoHS_L_10.pdf?src-supplier=Digi-Key; ComponentLink2URL: http://www.yageo.com/documents/recent/PYu-RC_Group_51_RoHS_L_9.pdf?src-supplier=Mouser; ComponentLink2Description: http://www.yageo.com/documents/recent/PYu-RC_Group_51_RoHS_L_9.pdf?src-supplier=Mouser; ComponentLink3URL: http://documents.rs-components.com/techlib://itc_doclist_GB.htm?stockno=6185113&src-supplier=RSComponents; ComponentLink3Description: http://documents.rs-components.com/techlib://itc_doclist_GB.htm?stockno=6185113&src-supplier=RSComponents; ComponentLink4URL: http://www.yageo.ru/pdf/RC0805.pdf?src-supplier=Future+Electronics; ComponentLink4Description: http://www.yageo.ru/pdf/RC0805.pdf?src-supplier=Future+Electronics; ComponentLink5URL: http://www.farnell.com/datasheets/38627.pdf?src-supplier=Element14; ComponentLink5Description: http://www.farnell.com/datasheets/38627.pdf?src-supplier=Element14; ComponentLink6URL: http://www.farnell.com/datasheets/2167052.pdf?src-supplier=Element14; ComponentLink6Description: http://www.farnell.com/datasheets/2167052.pdf?src-supplier=Element14; ComponentLink7URL: http://www.farnell.com/datasheets/1686128.pdf?src-supplier=Element14; ComponentLink7Description: http://www.farnell.com/datasheets/1686128.pdf?src-supplier=Element14; ComponentLink8URL: http://www.farnell.com/datasheets/444164.pdf?src-supplier=Element14; ComponentLink8Description: http://www.farnell.com/datasheets/444164.pdf?src-supplier=Element14; Supplier Part Number 1: 311-100KCRCT-ND
R2 R3 R15 R17 R22 = RC0805FR-07560RL: Surface Mount Thick Film Resistor, RC Series, 560 ohm, 125 mW, - 1%, 150 V, 0805 [2012 Metric]; Manufacturer: Yageo; Resistance: 560R; Power Rating: 125mW; Temperature Coefficient: 100ppm/°C; Voltage Rating: 150V; Supplier 1: Digi-Key; Manufacturer Part Number: RC0805FR-07560RL; Stock 1: 90211; Pricing 1: 1=0.1, 10=0.039, 100=0.0157, 1000=0.0071, 2500=0.0061 (USD); Case/Package: 0805; Weight: 0.000194oz; Case Code (Metric): 2012; Case Code (Imperial): 0805; Min Operating Temperature: -55°C; Max Operating Temperature: 155°C; Tolerance: 1%; Packaging: Tape and Reel; Package Quantity: 1; Composition: Thick Film; Number of Terminations: 2; Termination: SMD/SMT; Military Standard: Not; Max Power Dissipation: 125mW; Features: Moisture Resistant; Length: 2mm; Height: 0.5mm; Width: 0.049inch; Depth: 1.25mm; REACH SVHC: Unknown; Lead Free: Lead Free; ComponentLink1URL: http://www.yageo.com/documents/recent/PYu-RC_Group_51_RoHS_L_10.pdf?src-supplier=Digi-Key; ComponentLink1Description: http://www.yageo.com/documents/recent/PYu-RC_Group_51_RoHS_L_10.pdf?src-supplier=Digi-Key; ComponentLink2URL: http://www.yageo.com/documents/recent/PYu-RC_Group_51_RoHS_L_9.pdf?src-supplier=Mouser; ComponentLink2Description: http://www.yageo.com/documents/recent/PYu-RC_Group_51_RoHS_L_9.pdf?src-supplier=Mouser; ComponentLink3URL: http://www.farnell.com/datasheets/2167052.pdf?src-supplier=Element14; ComponentLink3Description: http://www.farnell.com/datasheets/2167052.pdf?src-supplier=Element14; Supplier Part Number 1: 311-560CRCT-ND
R4 R14 R18-R21 = RC0805FR-0710KL: RES SMD 10K OHM 1% 1/8W 0805; Manufacturer: Yageo; Resistance: 10kR; Temperature Coefficient: 100ppm/°C; Power Rating: 125mW; Voltage Rating: 150V; Supplier 1: Digi-Key; Manufacturer Part Number: RC0805FR-0710KL; Stock 1: 20734617; Pricing 1: 1=0.1, 10=0.039, 100=0.0157, 1000=0.0071, 2500=0.0061 (USD); Case/Package: 0805; Case Code (Imperial): 0805; Case Code (Metric): 2012; Min Operating Temperature: -55°C; Max Operating Temperature: 155°C; Packaging: Tape and Reel; Tolerance: 1%; Composition: Thick Film; Package Quantity: 1; Termination: SMD/SMT; Number of Terminations: 2; Military Standard: Not; Max Power Dissipation: 125mW; Features: Moisture Resistant; Length: 2mm; Height: 0.024inch; Width: 0.049inch; Depth: 1.25mm; REACH SVHC: Unknown; Lead Free: Lead Free; ComponentLink1URL: http://www.yageo.com/documents/recent/PYu-RC_Group_51_RoHS_L_9.pdf?src-supplier=Mouser; ComponentLink1Description: http://www.yageo.com/documents/recent/PYu-RC_Group_51_RoHS_L_9.pdf?src-supplier=Mouser; ComponentLink2URL: http://www.farnell.com/datasheets/2167052.pdf?src-supplier=Element14; ComponentLink2Description: http://www.farnell.com/datasheets/2167052.pdf?src-supplier=Element14; ComponentLink3URL: http://www.yageo.com/documents/recent/PYu-RC_Group_51_RoHS_L_10.pdf?src-supplier=Digi-Key; ComponentLink3Description: http://www.yageo.com/documents/recent/PYu-RC_Group_51_RoHS_L_10.pdf?src-supplier=Digi-Key; ComponentLink4URL: http://www.yageo.ru/pdf/RC0805.pdf?src-supplier=Future+Electronics; ComponentLink4Description: http://www.yageo.ru/pdf/RC0805.pdf?src-supplier=Future+Electronics; Supplier Part Number 1: 311-10.0KCRCT-ND
R5-R7 R13 R23-R25 = RC0805FR-0722RL: RES SMD 22 OHM 1% 1/8W 0805; Manufacturer: Yageo; Temperature Coefficient: 100ppm/°C; Power Rating: 125mW; Voltage Rating: 150V; Supplier 1: Digi-Key; Manufacturer Part Number: RC0805FR-0722RL; Stock 1: 512730; Pricing 1: 1=0.1, 10=0.04, 100=0.0163, 1000=0.0073, 2500=0.0064 (USD); Case/Package: 0805; Case Code (Metric): 2012; Case Code (Imperial): 0805; Min Operating Temperature: -55°C; Max Operating Temperature: 155°C; Composition: Thick Film; Resistance: 22R; Tolerance: 1%; Packaging: Tape and Reel; Package Quantity: 1; Number of Terminations: 2; Termination: SMD/SMT; Military Standard: Not; Max Power Dissipation: 125mW; Working Voltage: 150V; Features: Moisture Resistant; Length: 0.079inch; Height: 0.024inch; Width: 0.049inch; Depth: 1.25mm; REACH SVHC: Unknown; Lead Free: Lead Free; ComponentLink1URL: http://www.yageo.com/documents/recent/PYu-RC_Group_51_RoHS_L_10.pdf?src-supplier=Digi-Key; ComponentLink1Description: http://www.yageo.com/documents/recent/PYu-RC_Group_51_RoHS_L_10.pdf?src-supplier=Digi-Key; ComponentLink2URL: http://www.farnell.com/datasheets/444164.pdf?src-supplier=Element14; ComponentLink2Description: http://www.farnell.com/datasheets/444164.pdf?src-supplier=Element14; ComponentLink3URL: http://www.yageo.com/documents/recent/PYu-RC_Group_51_RoHS_L_9.pdf?src-supplier=Mouser; ComponentLink3Description: http://www.yageo.com/documents/recent/PYu-RC_Group_51_RoHS_L_9.pdf?src-supplier=Mouser; Supplier Part Number 1: 311-22.0CRCT-ND
R8 R26-R28 = RC0805JR-070RL: Surface Mount Thick Film Resistor, RC Series, 125 mW, - 5%, 150 V, 0805 [2012 Metric]; Manufacturer: Yageo; Resistance: 0mR; Voltage Rating: 150V; Power Rating: 125mW; Temperature Coefficient: 200ppm/°C; Supplier 1: Digi-Key; Manufacturer Part Number: RC0805JR-070RL; Stock 1: 6616330; Pricing 1: 1=0.1, 10=0.033, 25=0.024, 50=0.0184, 100=0.0135, 250=0.0103, 500=0.0082, 1000=0.0061 (USD); Case/Package: 0805; Number of Pins: 2; Case Code (Imperial): 0805; Case Code (Metric): 2012; Contact Plating: Tin,Matte; Min Operating Temperature: -55°C; Max Operating Temperature: 155°C; Packaging: Tape and Reel; Tolerance: 5%; Voltage Rating (DC): 150V; Termination: SMD/SMT; Composition: Thick Film; Military Standard: Not; Length: 2mm; Height: 0.5mm; Width: 1.25mm; Depth: 1.25mm; Radiation Hardening: No; REACH SVHC: Unknown; Lead Free: Lead Free; ComponentLink1URL: http://www.farnell.com/datasheets/2167052.pdf?src-supplier=Element14; ComponentLink1Description: http://www.farnell.com/datasheets/2167052.pdf?src-supplier=Element14; ComponentLink2URL: http://documents.rs-components.com/techlib://itc_doclist_GB.htm?stockno=6185129&src-supplier=RSComponents; ComponentLink2Description: http://documents.rs-components.com/techlib://itc_doclist_GB.htm?stockno=6185129&src-supplier=RSComponents; ComponentLink3URL: https://www.verical.com/server-webapp/html/getDatasheet?partID=330685&src-supplier=Verical; ComponentLink3Description: https://www.verical.com/server-webapp/html/getDatasheet?partID=330685&src-supplier=Verical; Supplier Part Number 1: 311-0.0ARCT-ND
R9 R16 = RC0805FR-071ML: RES SMD 1M OHM 1% 1/8W 0805; Manufacturer: Yageo; Resistance: 1MR; Temperature Coefficient: 100ppm/°C; Power Rating: 125mW; Voltage Rating: 150V; Supplier 1: Digi-Key; Manufacturer Part Number: RC0805FR-071ML; Stock 1: 3436793; Pricing 1: 1=0.1, 10=0.04, 100=0.0163, 1000=0.0073, 2500=0.0064 (USD); Case/Package: 0805; Case Code (Metric): 2012; Case Code (Imperial): 0805; Min Operating Temperature: -55°C; Max Operating Temperature: 155°C; Tolerance: 1%; Composition: Thick Film; Packaging: Tape and Reel; Package Quantity: 1; Number of Terminations: 2; Termination: SMD/SMT; Military Standard: Not; Max Power Dissipation: 125mW; Features: Moisture Resistant; Length: 0.079inch; Height: 0.024inch; Width: 0.049inch; Depth: 1.25mm; REACH SVHC: Unknown; Lead Free: Lead Free; ComponentLink1URL: http://www.yageo.com/documents/recent/PYu-RC_Group_51_RoHS_L_10.pdf?src-supplier=Digi-Key; ComponentLink1Description: http://www.yageo.com/documents/recent/PYu-RC_Group_51_RoHS_L_10.pdf?src-supplier=Digi-Key; ComponentLink2URL: http://www.yageo.ru/pdf/RC0805.pdf?src-supplier=Future+Electronics; ComponentLink2Description: http://www.yageo.ru/pdf/RC0805.pdf?src-supplier=Future+Electronics; ComponentLink3URL: http://www.yageo.com/documents/recent/PYu-RC_Group_51_RoHS_L_9.pdf?src-supplier=Mouser; ComponentLink3Description: http://www.yageo.com/documents/recent/PYu-RC_Group_51_RoHS_L_9.pdf?src-supplier=Mouser; Supplier Part Number 1: 311-1.00MCRCT-ND
R10-R12 = RC0805FR-071KL: RESISTOR, 0805 1K 1%, FULL REEL; Product Range:YAGEO - RC Series; Resistance:1kohm; Power Rating:125mW; Resistance Tolerance:± 1%; Resistor Case Style:0805 [2012 Metric]; Resistor Element Material:Thick Film; Temperature Coefficient:± 250ppm/°C; Voltage Rating:150V; Packaging:Tape & Reel; MSL:-; SVHC:No SVHC (16-Dec-2013); External Depth:0.55mm; External Length / Height:2mm; External Width:1.25mm; No. of Pins:2; Operating Temperature Max:155°C; Operating Temperature Min:-55°C; Operating Temperature Range:-55°C to +155°C; Reel Quantity:5000; Resistor Mounting:SMD; Series:RC12H; Temperature Coef; Manufacturer: Yageo; Resistance: 1kR; Temperature Coefficient: 100ppm/°C; Voltage Rating (DC): 150V; Power Rating: 125mW; Supplier 1: Digi-Key; Manufacturer Part Number: RC0805FR-071KL; Stock 1: 18856024; Pricing 1: 1=0.1, 10=0.04, 100=0.0163, 1000=0.0073, 2500=0.0064 (USD); Case/Package: 0805; Number of Pins: 2; Case Code (Metric): 2012; Case Code (Imperial): 0805; Min Operating Temperature: -55°C; Max Operating Temperature: 155°C; Tolerance: 1%; Packaging: Tape and Reel; Composition: Thick Film; Package Quantity: 1; Voltage Rating: 150V; Number of Terminations: 2; Termination: SMD/SMT; Military Standard: Not; Max Power Dissipation: 125mW; Features: Moisture Resistant; Length: 0.079inch; Height: 0.024inch; Width: 0.049inch; Depth: 1.25mm; REACH SVHC: Unknown; Lead Free: Lead Free; ComponentLink1URL: http://www.yageo.com/documents/recent/PYu-RC_Group_51_RoHS_L_10.pdf?src-supplier=Digi-Key; ComponentLink1Description: http://www.yageo.com/documents/recent/PYu-RC_Group_51_RoHS_L_10.pdf?src-supplier=Digi-Key; ComponentLink2URL: http://www.farnell.com/datasheets/1686128.pdf?src-supplier=Element14; ComponentLink2Description: http://www.farnell.com/datasheets/1686128.pdf?src-supplier=Element14; ComponentLink3URL: http://www.yageo.ru/pdf/RC0805.pdf?src-supplier=Future+Electronics; ComponentLink3Description: http://www.yageo.ru/pdf/RC0805.pdf?src-supplier=Future+Electronics; ComponentLink4URL: http://www.farnell.com/datasheets/2167052.pdf?src-supplier=Element14; ComponentLink4Description: http://www.farnell.com/datasheets/2167052.pdf?src-supplier=Element14; Supplier Part Number 1: 311-1.00KCRCT-ND
SCKT_FOR_U1 = 4828-3004-CP: CONN IC DIP SOCKET 28POS TIN; Manufacturer: 3M; Number of Contacts: 28; Gender: Female; Insulation Resistance: 5GR; Current Rating: 1A; Pitch: 2.54mm; Row Spacing: 7.62mm; Supplier 1: Avnet; Manufacturer Part Number: 4828-3004-CP; Stock 1: 0; Pricing 1: 5600=0.4156, 11200=0.4054, 22400=0.3997, 33600=0.3883, 44800=0.3797, 56000=0.3712, 560000=0.3626 (USD); Mount: Through Hole; Contact Plating: Tin; Contact Material: Bronze; Housing Material: Glass; Insulation Material: Polyester; Min Operating Temperature: -25°C; Max Operating Temperature: 85°C; Number of Rows: 2; Termination: Solder; Orientation: Straight; Package Quantity: 5600; Number of Positions: 28; Connector Type: DIP; Series: 4800; Length: 35.43mm; Width: 10.16mm; Depth: 10.16mm; REACH SVHC: Unknown; Lead Free: Lead Free; ComponentLink1URL: http://multimedia.3m.com/mws/media/218496O/3mtm-dip-socket-4800-series-ts1099.pdf?src-supplier=Digi-Key; ComponentLink1Description: http://multimedia.3m.com/mws/media/218496O/3mtm-dip-socket-4800-series-ts1099.pdf?src-supplier=Digi-Key; Supplier Part Number 1: 7010501790
SW1 SW2 = FSM4JH: TE CONNECTIVITY / ALCOSWITCH - FSM4JH - SWITCH, SPNO, 0.05A; Mechanical Life: 100000Cycles; Actuator Material: Resin,Polyacetal; Contact Current Rating: 50mA; Operating Force: 160gf; Contact Resistance: 100mR; Throw Configuration: SPST,DPST; Max Voltage Rating (DC): 12V; Illumination Type: Non-Illuminated,Illuminated; Switch Travel: 0.25mm; Switch Function: Off-Mom; Actuator Type: Standard; Actuator Length: 1.4mm; Supplier 1: Digi-Key; Manufacturer: TE Connectivity; Manufacturer Part Number: FSM4JH; Stock 1: 8338; Pricing 1: 1=0.1, 10=0.101, 25=0.0956, 100=0.087, 250=0.0818, 500=0.0748, 1000=0.0627, 2500=0.0609, 5000=0.0574 (USD); Mount: Through Hole; Contact Material: Copper Alloy; Contact Plating: Silver; Material: Nylon; Min Operating Temperature: -35°C; Max Operating Temperature: 85°C; Package Quantity: 750; Packaging: Loose Piece; Termination: PC Pin; Electrical Life: 100000Cycles; Orientation: Straight; Type: Switch; Voltage Rating (DC): 12V; Current Rating: 50mA; Insulation Resistance: 100MR; REACH SVHC: Unknown; ELV: Compliant; ComponentLink1URL: http://www.farnell.com/datasheets/921681.pdf?src-supplier=Element14; ComponentLink1Description: http://www.farnell.com/datasheets/921681.pdf?src-supplier=Element14; ComponentLink2URL: https://www.alliedelec.com/m/d/eaa16fe89a3a8acf140f751379b52364.pdf?src-supplier=Allied+Electronics; ComponentLink2Description: https://www.alliedelec.com/m/d/eaa16fe89a3a8acf140f751379b52364.pdf?src-supplier=Allied+Electronics; Supplier Part Number 1: 450-1650-ND